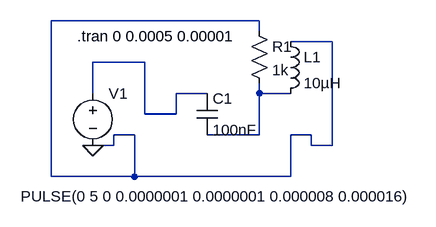
[diagram p0: schematic LC.asc]
LC.asc, the LTspice schematic file:
Version 4
SHEET 1 880 680
WIRE 384 144 64 144
WIRE 384 160 384 144
WIRE 496 176 432 176
WIRE 208 208 128 208
WIRE 128 256 128 208
WIRE 304 256 256 256
WIRE 384 256 384 240
WIRE 432 256 384 256
WIRE 208 288 208 208
WIRE 256 288 256 256
WIRE 256 288 208 288
WIRE 192 320 160 320
WIRE 384 320 384 256
WIRE 384 320 304 320
WIRE 464 320 432 320
WIRE 160 336 160 320
WIRE 160 336 128 336
WIRE 464 336 464 320
WIRE 496 336 496 176
WIRE 496 336 464 336
WIRE 64 384 64 144
WIRE 192 384 192 320
WIRE 192 384 64 384
WIRE 432 384 432 320
WIRE 432 384 192 384
FLAG 128 336 0
SYMBOL voltage 128 240 R0
WINDOW 3 -111 175 Left 2
SYMATTR Value PULSE(0 5 0 0.0000001 0.0000001 0.000008 0.000016)
SYMATTR InstName V1
SYMBOL cap 288 256 R0
SYMATTR InstName C1
SYMATTR Value 100nF
SYMBOL ind 416 160 R0
SYMATTR InstName L1
SYMATTR Value 10µH
SYMATTR SpiceLine Rser=50
SYMBOL res 368 144 R0
SYMATTR InstName R1
SYMATTR Value 1k
TEXT 104 168 Left 2 !.tran 0 0.0005 0.00001

The netlist it stands for:
* LC.asc
V1 N001 0 PULSE(0 5 0 0.0000001 0.0000001 0.000008 0.000016)
C1 N001 N002 100nF
L1 0 N002 10µH Rser=50
R1 0 N002 1k
.tran 0 0.0005 0.00001
.backanno
.end